# Altium project User-Controller.PrjPcb
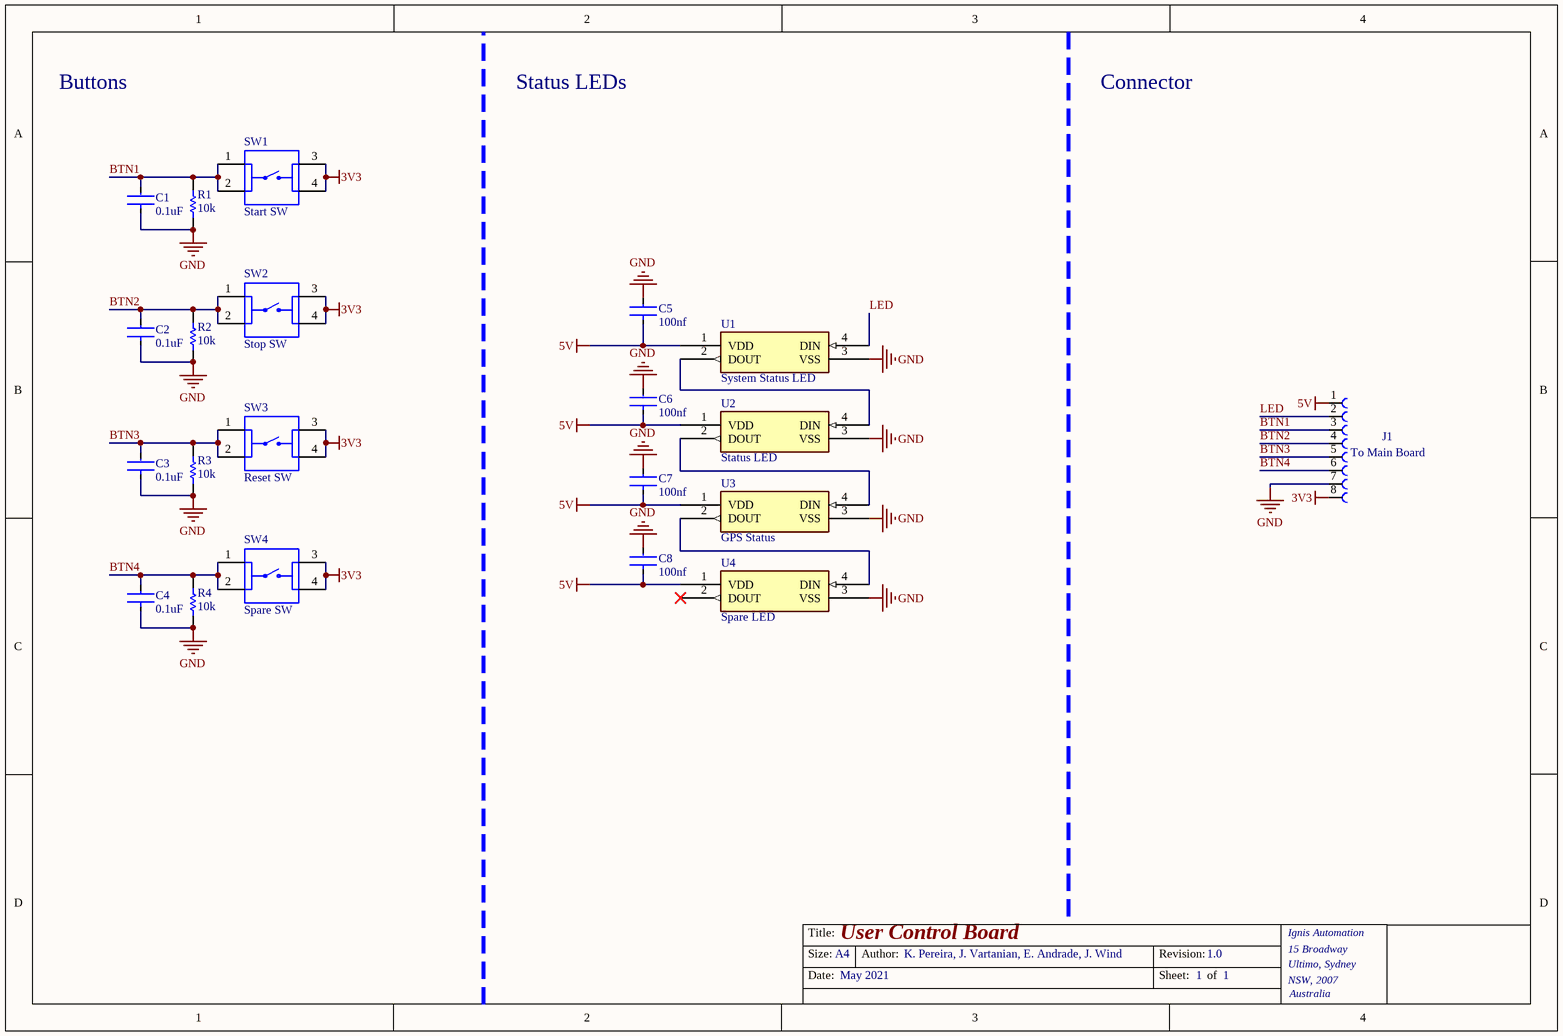
[diagram p0: User-Control.SchDoc]
1 sheet, 21 parts. Net scope: global (net labels, ports and power ports of the same name join across sheets).
Board file: User-Controller.PcbDoc

## Sheet User-Control.SchDoc: User Control Board
size A4; Date: May 2021; Revision: 1.0; SheetNumber: 1; SheetTotal: 1

### Parts
C1  0.1uF  [FP-CL10-IPC_C]
C2  0.1uF  [FP-CL10-IPC_C]
C3  0.1uF  [FP-CL10-IPC_C]
C4  0.1uF  [FP-CL10-IPC_C]
C5  100nf  [FP-CL10-IPC_C]
C6  100nf  [FP-CL10-IPC_C]
C7  100nf  [FP-CL10-IPC_C]
C8  100nf  [FP-CL10-IPC_C]
J1  To Main Board  [61300711821]
R1  10k  [RESC1608X55X30NL15T15]
R2  10k  [RESC1608X55X30NL15T15]
R3  10k  [RESC1608X55X30NL15T15]
R4  10k  [RESC1608X55X30NL15T15]
SW1  Start SW  [SW_1825910-6-4]
SW2  Stop SW  [SW_1825910-6-4]
SW3  Reset SW  [SW_1825910-6-4]
SW4  Spare SW  [SW_1825910-6-4]
U1  System Status LED  [WS2812B_WDS]
U2  Status LED  [WS2812B_WDS]
U3  GPS Status  [WS2812B_WDS]
U4  Spare LED  [WS2812B_WDS]

### Nets
3V3: J1.8 SW1.3 SW1.4 SW2.3 SW2.4 SW3.3 SW3.4 SW4.3 SW4.4
5V: C5.1 C6.1 C7.1 C8.1 J1.1 U1.1(VDD) U2.1(VDD) U3.1(VDD) U4.1(VDD)
GND: C1.1 C2.1 C3.1 C4.1 C5.2 C6.2 C7.2 C8.2 J1.7 R1.1 R2.1 R3.1 R4.1 U1.3(VSS) U2.3(VSS) U3.3(VSS) U4.3(VSS)
BTN1: C1.2 J1.3 R1.2 SW1.1 SW1.2
BTN2: C2.2 J1.4 R2.2 SW2.1 SW2.2
BTN3: C3.2 J1.5 R3.2 SW3.1 SW3.2
BTN4: C4.2 J1.6 R4.2 SW4.1 SW4.2
LED: J1.2 U1.4(DIN)
NetU1_2: U1.2(DOUT) U2.4(DIN)
NetU2_2: U2.2(DOUT) U3.4(DIN)
NetU3_2: U3.2(DOUT) U4.4(DIN)

Not connected (* = marked no-connect by the designer): U4 2(DOUT)*

### Notes on the sheet
- Buttons
- Status LEDs
- Connector
- Title:
- Size:
- Date:
- A4
- Author:
- K. Pereira, J. Vartanian, E. Andrade, J. Wind
- Revision:
- Sheet:
- of
- Ignis Automation
- 15 Broadway
- Ultimo, Sydney
- NSW, 2007
- Australia

### Library data of the parts
C1-C8 = CMP-13271-003248-1: CAP CER 0.1UF 50V X7R 0603; Part Number: 1276-CL10B104KB8NNNLCT-ND
J1 = 61300711821: Single Row / Straight / Without Shroud Female header Female 7 ¦ WÃ¼rth Elektronik 61300711821 @ Pin header, socket (Si...; MF: WÃ¼rth Elektronik; Check_prices: https://www.snapeda.com/parts/61300711821/W%C3%BCrth%20Elektronik/view-part/2704590/?ref=eda; Price: None; Availability: Unavailable; Value: *; SnapEDA_Link: https://www.snapeda.com/parts/61300711821/W%C3%BCrth%20Elektronik/view-part/2704590/?ref=snap; Package: None; MP: 61300711821
R1-R4 = CMP-2000-00180-1: RES SMD 10K OHM 1% 1/10W 0603; Part Number: A121523CT-ND
SW1-SW4 = 1825910-6: SWITCH TACTILE SPST-NO 0.05A 24V; Part Number: 450-1650-ND
U1-U4 = WS2812B: Part Number: WS2812B